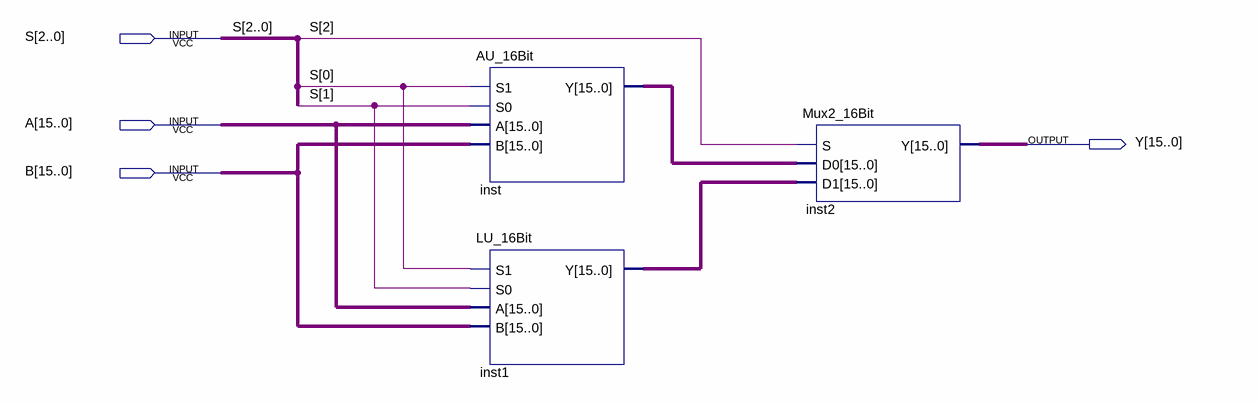
[diagram p0: schematic sheet]
// Quartus schematic ALU_16Bit.bdf as structural Verilog: 3 symbols, 4 pins
module ALU_16Bit (
  input  [2:0] S,
  input  [15:0] A,
  input  [15:0] B,
  output [15:0] Y
);

  wire [15:0] inst1_y, inst_y;

  AU_16Bit inst (.S1(S[0]), .S0(S[1]), .A(A), .B(B), .Y(inst_y));
  LU_16Bit inst1 (.S1(S[0]), .S0(S[1]), .A(A), .B(B), .Y(inst1_y));
  Mux2_16Bit inst2 (.S(S[2]), .D0(inst_y), .D1(inst1_y), .Y(Y));
endmodule
